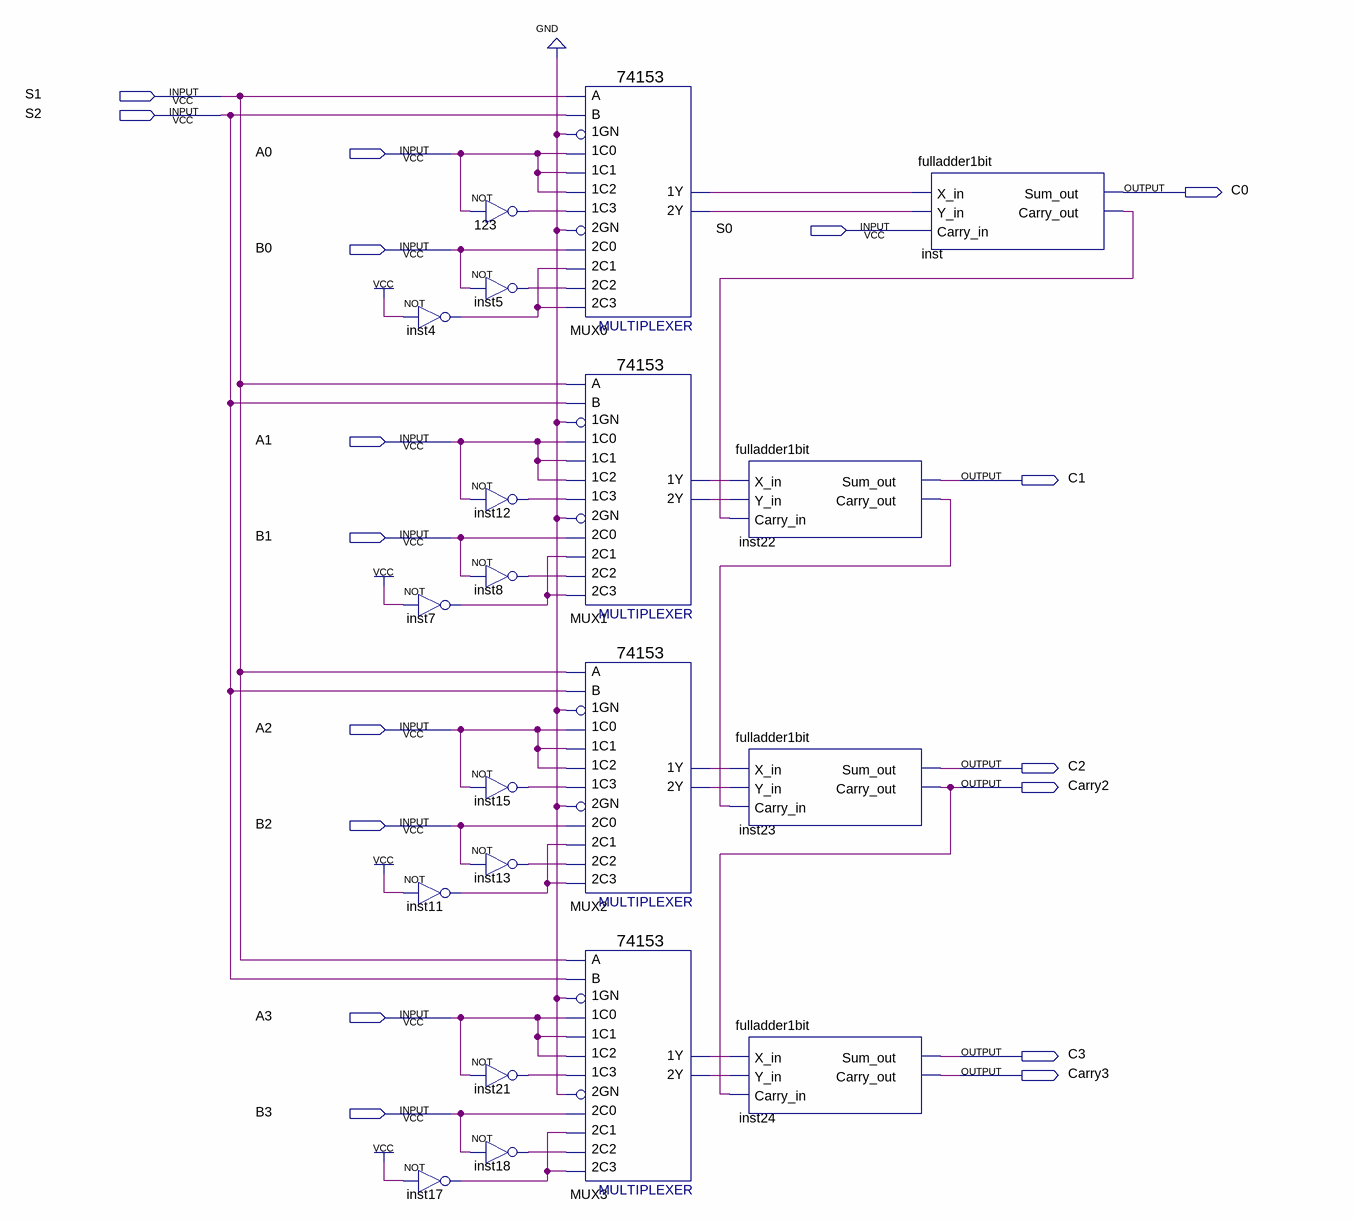
[diagram p0: schematic sheet]
// Quartus schematic arithcircuit4bits.bdf as structural Verilog: 20 symbols, 17 pins
module arithcircuit4bits (
  input  S1,
  input  S2,
  input  A0,
  input  S0,
  input  B0,
  input  A1,
  input  B1,
  input  A2,
  input  B2,
  input  A3,
  input  B3,
  output C0,
  output C1,
  output C2,
  output Carry2,
  output C3,
  output Carry3
);

  wire inst4_out, inst5_out, inst7_out, inst8_out, inst11_out, inst12_out, inst13_out, inst15_out,
       inst17_out, inst18_out, inst21_out, inst22_carry_out, inst_carry_out, MUX0_1y, MUX0_2y, MUX1_1y,
       MUX1_2y, MUX2_1y, MUX2_2y, MUX3_1y, MUX3_2y, n123_out;

  not inst4 (inst4_out, 1'b1);
  not inst7 (inst7_out, 1'b1);
  not inst11 (inst11_out, 1'b1);
  not inst17 (inst17_out, 1'b1);
  not u_123 (n123_out, A0);
  not inst5 (inst5_out, B0);
  not inst12 (inst12_out, A1);
  not inst8 (inst8_out, B1);
  not inst15 (inst15_out, A2);
  not inst13 (inst13_out, B2);
  not inst21 (inst21_out, A3);
  not inst18 (inst18_out, B3);
  \74153  MUX0 (
    .\1C1 (A0), .\1GN (1'b0), .\1C0 (A0), .\2C0 (B0), .\2GN (1'b0), .\2C2 (inst5_out), .\1C2 (A0),
    .\1C3 (n123_out), .B(S2), .A(S1), .\2C1 (inst4_out), .\2C3 (inst4_out), .\1Y (MUX0_1y), .\2Y (MUX0_2y));
  \74153  MUX1 (
    .\1C1 (A1), .\1GN (1'b0), .\1C0 (A1), .\2C0 (B1), .\2GN (1'b0), .\2C2 (inst8_out), .\1C2 (A1),
    .\1C3 (inst12_out), .B(S2), .A(S1), .\2C1 (inst7_out), .\2C3 (inst7_out), .\1Y (MUX1_1y), .\2Y (MUX1_2y));
  \74153  MUX2 (
    .\1C1 (A2), .\1GN (1'b0), .\1C0 (A2), .\2C0 (B2), .\2GN (1'b0), .\2C2 (inst13_out), .\1C2 (A2),
    .\1C3 (inst15_out), .B(S2), .A(S1), .\2C1 (inst11_out), .\2C3 (inst11_out), .\1Y (MUX2_1y), .\2Y (MUX2_2y));
  \74153  MUX3 (
    .\1C1 (A3), .\1GN (1'b0), .\1C0 (A3), .\2C0 (B3), .\2GN (1'b0), .\2C2 (inst18_out), .\1C2 (A3),
    .\1C3 (inst21_out), .B(S2), .A(S1), .\2C1 (inst17_out), .\2C3 (inst17_out), .\1Y (MUX3_1y), .\2Y (MUX3_2y));
  fulladder1bit inst22 (
    .X_in(MUX1_1y), .Y_in(MUX1_2y), .Carry_in(inst_carry_out), .Sum_out(C1), .Carry_out(inst22_carry_out));
  fulladder1bit inst23 (.X_in(MUX2_1y), .Y_in(MUX2_2y), .Carry_in(inst22_carry_out), .Sum_out(C2), .Carry_out(Carry2));
  fulladder1bit inst24 (.X_in(MUX3_1y), .Y_in(MUX3_2y), .Carry_in(Carry2), .Sum_out(C3), .Carry_out(Carry3));
  fulladder1bit inst (.X_in(MUX0_1y), .Y_in(MUX0_2y), .Carry_in(S0), .Sum_out(C0), .Carry_out(inst_carry_out));
endmodule
